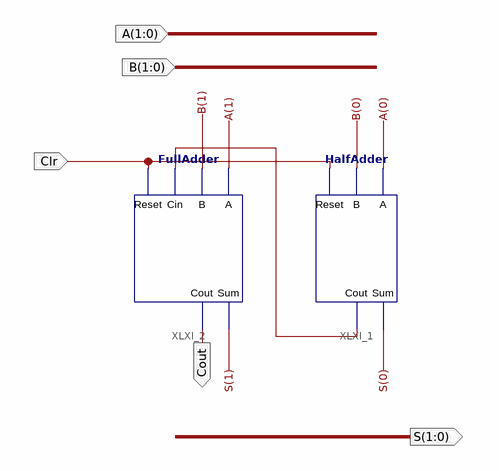
[diagram p0: schematic sheet 1]
// Xilinx ISE schematic Bit2Adder.sch (artix7) as structural Verilog: 2 symbols, 5 ports
module Bit2Adder (
  input  [1:0] A,
  input  [1:0] B,
  input  Clr,
  output [1:0] S,
  output Cout
);

  wire XLXN_15;

  HalfAdder XLXI_1 (.A(A[0]), .B(B[0]), .Cout(XLXN_15), .Reset(Clr), .Sum(S[0]));
  FullAdder XLXI_2 (.A(A[1]), .B(B[1]), .Cin(XLXN_15), .Cout(Cout), .Reset(Clr), .Sum(S[1]));
endmodule
